# Altium schematic sheet 04_MR_WOLF.SchDoc: Wearable Ultra Low-Power Ultrasound probe
size A3; DrawnBy: Sebastian Frey; Organization: Integrated Systems Laboratory; Revision: v1.0; SheetNumber: 5; SheetTotal: 6
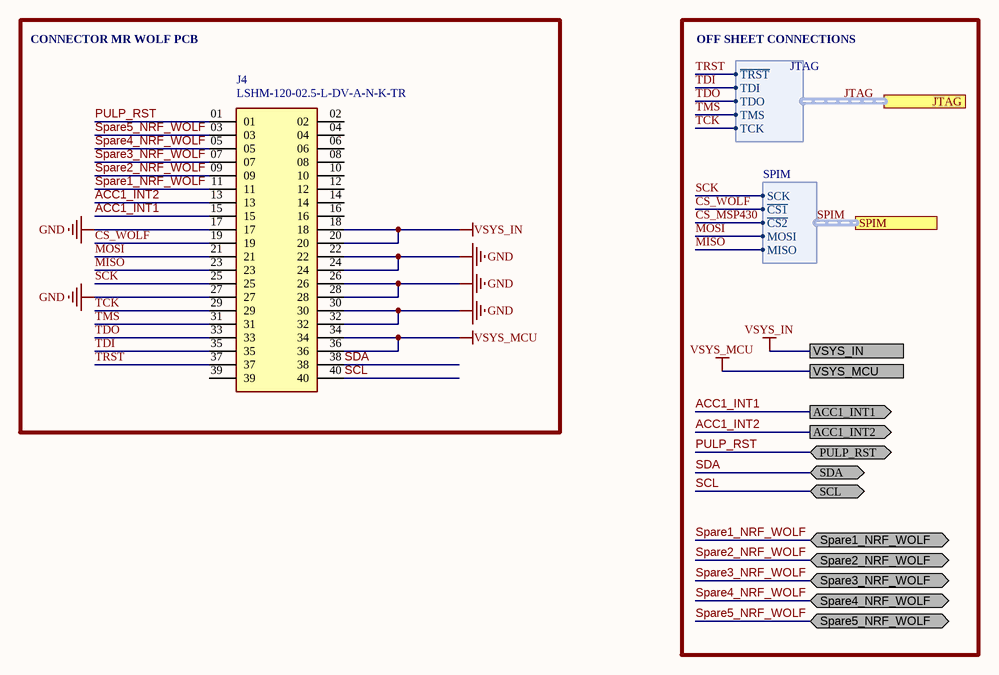
[diagram p0: 04_MR_WOLF.SchDoc]

## Parts
J4  LSHM-120-02.5-L-DV-A-N-K-TR  [SAMTEC_LSHM-120-XX.X-X-DV-A-N-XX]

## Blocks framed on the sheet
CONNECTOR MR WOLF PCB: J4

## Ports
ACC1_INT1 (out), ACC1_INT2 (out), JTAG (harness JTAG), PULP_RST (bidir), SCL (bidir), SDA (bidir), Spare1_NRF_WOLF (bidir), Spare2_NRF_WOLF (bidir), Spare3_NRF_WOLF (bidir), Spare4_NRF_WOLF (bidir), Spare5_NRF_WOLF (bidir), SPIM (harness SPIM), VSYS_IN, VSYS_MCU

## Harnesses
JTAG: ~{TRST}, TCK, TMS, TDI, TDO
SPIM: SCK, ~{CS1}, ~{CS2}, MOSI, MISO

## Nets
GND: J4.17 J4.22 J4.24 J4.26 J4.27 J4.28 J4.30 J4.32
VSYS_IN: J4.18 J4.20 ; port VSYS_IN
VSYS_MCU: J4.34 J4.36 ; port VSYS_MCU
ACC1_INT1: J4.15 ; port ACC1_INT1
ACC1_INT2: J4.13 ; port ACC1_INT2
CS_MSP430: port SPIM.~{CS2}
CS_WOLF: J4.19 ; port SPIM.~{CS1}
MISO: J4.23 ; port SPIM.MISO
MOSI: J4.21 ; port SPIM.MOSI
PULP_RST: J4.01 ; port PULP_RST
SCK: J4.25 ; port SPIM.SCK
SCL: J4.40 ; port SCL
SDA: J4.38 ; port SDA
Spare1_NRF_WOLF: J4.11 ; port Spare1_NRF_WOLF
Spare2_NRF_WOLF: J4.09 ; port Spare2_NRF_WOLF
Spare3_NRF_WOLF: J4.07 ; port Spare3_NRF_WOLF
Spare4_NRF_WOLF: J4.05 ; port Spare4_NRF_WOLF
Spare5_NRF_WOLF: J4.03 ; port Spare5_NRF_WOLF
TCK: J4.29 ; port JTAG.TCK  [project net JTAG.TCK]
TDI: J4.35 ; port JTAG.TDI  [project net JTAG.TDI]
TDO: J4.33 ; port JTAG.TDO  [project net JTAG.TDO]
TMS: J4.31 ; port JTAG.TMS  [project net JTAG.TMS]
TRST: J4.37 ; port JTAG.~{TRST}  [project net JTAG.~{TRST}]

Not connected (* = marked no-connect by the designer): J4 02 04 06 08 10 12 14 16 39

## Buses and harness runs
harness JTAG = port JTAG
harness SPIM = port SPIM

## Notes on the sheet
- OFF SHEET CONNECTIONS
- 1
- 2
- 3
- 4
- 5
- 6
- 7
- 8
- A
- B
- C
- D
- Project:
- Date:
- Drawing number:
- Rev:
- Format:
- A3
- Drawn by:
- Laboratory:
- Page
- Sheet:
- of
- File:

## Library data of the parts
J4 = LSHM-120-02.5-L-DV-A-N-K-TR: Conn Socket and Terminal Strip HDR/SKT 40 POS 0.5mm Solder ST SMD T/R; Manufacturer: Samtec; Number of Contacts: 40; Supplier 1: Digi-Key; RoHS: Yes; Category: Connectors; Stock 1: 3008; Pricing 1: 1=6.60000, 10=5.97000, 25=5.63960, 50=5.50200, 100=5.22690, 250=4.67672 (USD); Contact Plating: Gold; Contact Material: Bronze; Housing Color: Black; Housing Material: Polymer; Min Operating Temperature: -55°C; Max Operating Temperature: 125°C; Number of Rows: 2; Termination: Solder; Packaging: Tape and Reel; Orientation: Straight; Series: LSH; Length: 14.7mm; Pitch: 0.5mm; Depth: 4.98mm; Radiation Hardening: No; REACH SVHC: No SVHC; RoHS Compliant: Yes; ComponentLink1URL: http://www.farnell.com/datasheets/2372721.pdf?src-supplier=Farnell; ComponentLink1Description: http://www.farnell.com/datasheets/2372721.pdf?src-supplier=Farnell; ComponentLink2URL: http://www.farnell.com/datasheets/2000266.pdf?src-supplier=Farnell; ComponentLink2Description: http://www.farnell.com/datasheets/2000266.pdf?src-supplier=Farnell; ComponentLink3URL: http://components.arrow.com/part/dataview/0323_01943898?src-supplier=Arrow+Europe; ComponentLink3Description: http://components.arrow.com/part/dataview/0323_01943898?src-supplier=Arrow+Europe; ComponentLink4URL: http://components.arrow.com/part/dataview/48680868S8397842N1004?src-supplier=Arrow+Electronics; ComponentLink4Description: http://components.arrow.com/part/dataview/48680868S8397842N1004?src-supplier=Arrow+Electronics; ComponentLink5URL: http://www.farnell.com/datasheets/2000266.pdf?src-supplier=Element14; ComponentLink5Description: http://www.farnell.com/datasheets/2000266.pdf?src-supplier=Element14; ComponentLink6URL: http://suddendocs.samtec.com/prints/lshm-1xx-xx.x-xx-dv-a-x-x-tr-mkt.pdf?src-supplier=Digi-Key; ComponentLink6Description: http://suddendocs.samtec.com/prints/lshm-1xx-xx.x-xx-dv-a-x-x-tr-mkt.pdf?src-supplier=Digi-Key; ComponentLink7URL: ftp://ftp.samtec.com/webfiles/PDF/LSHM.PDF?src-supplier=Avnet; ComponentLink7Description: ftp://ftp.samtec.com/webfiles/PDF/LSHM.PDF?src-supplier=Avnet; ComponentLink8URL: ftp://ftp.samtec.com/webfiles/PDF/LSHM.PDF?src-supplier=Avnet+Europe; ComponentLink8Description: ftp://ftp.samtec.com/webfiles/PDF/LSHM.PDF?src-supplier=Avnet+Europe; ComponentLink9URL: http://www.farnell.com/datasheets/2372721.pdf?src-supplier=Newark; ComponentLink9Description: http://www.farnell.com/datasheets/2372721.pdf?src-supplier=Newark; Supplier Part Number 1: SAM13196CT-ND; Manufacturer Part Number: LSHM-120-02.5-L-DV-A-N-K-TR